# EAGLE design sous-vide (EAGLE 6.6.0)
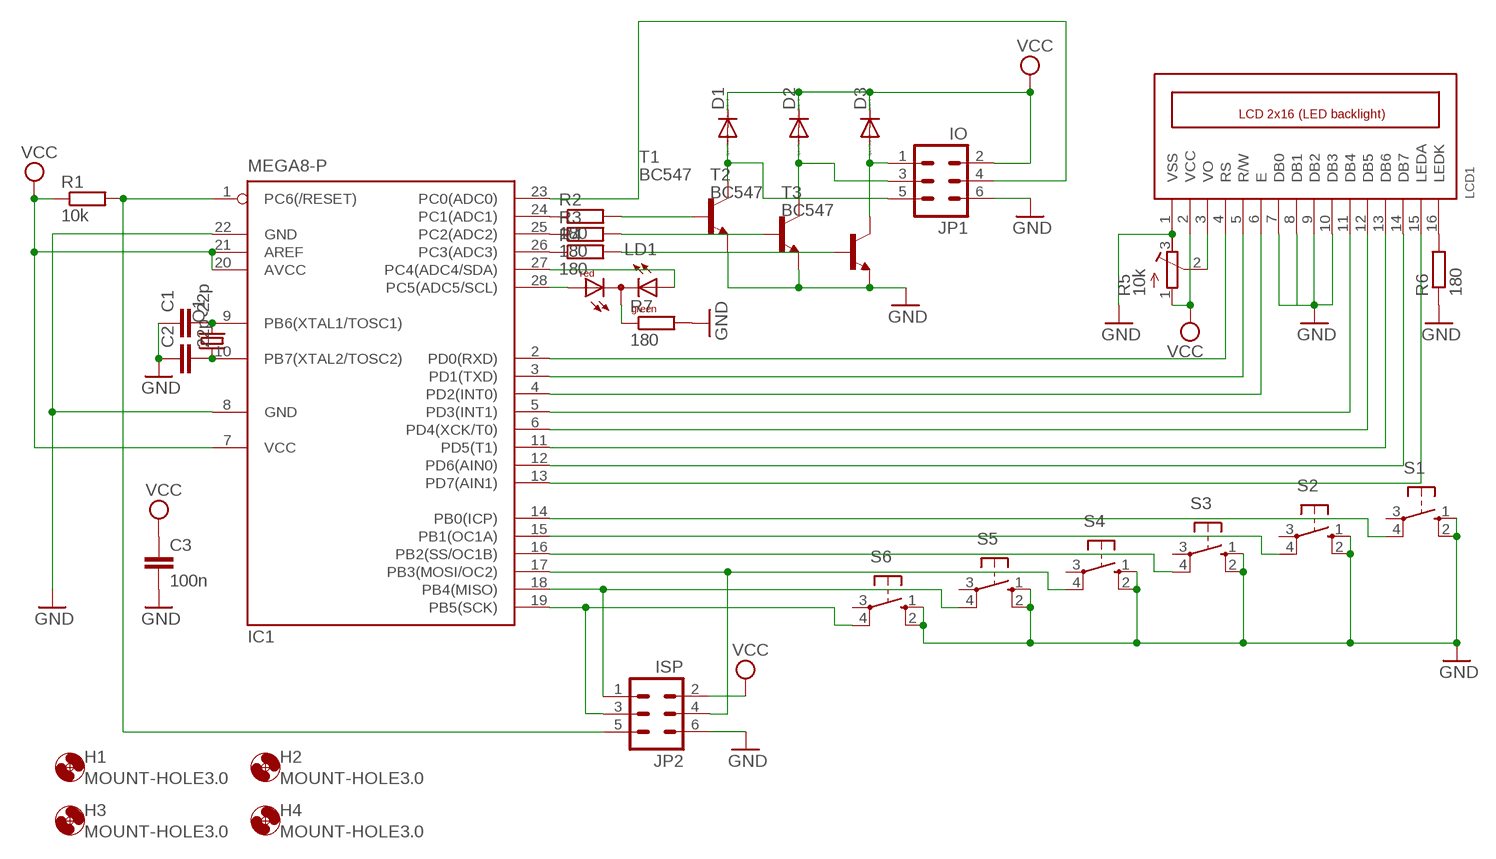
[diagram p0: schematic, sheet 1]

## Parts
C1  22p  C-EU025-025X050  [C025-025X050]
C2  22p  C-EU025-025X050  [C025-025X050]
C3  100n  C-EU025-025X050  [C025-025X050]
D1  DIODE-D-2.5  [D-2.5]
D2  DIODE-D-2.5  [D-2.5]
D3  DIODE-D-2.5  [D-2.5]
H1  MOUNT-HOLE3.0  [3,0]
H2  MOUNT-HOLE3.0  [3,0]
H3  MOUNT-HOLE3.0  [3,0]
H4  MOUNT-HOLE3.0  [3,0]
IC1  MEGA8-P  [DIL28-3]
JP1  IO  ML6  [ML6]
JP2  ISP  ML6  [ML6]
LCD1  LCD_2X16_SIL  [HY-1602F]
LD1  DUOLED-RG-C  [DUOLED-C-5MM]
Q1  CRYSTALHC49U-V  [HC49U-V]
R1  10k  R-EU_0207/7  [0207/7]
R2  180  R-EU_0207/2V  [0207/2V]
R3  180  R-EU_0207/2V  [0207/2V]
R4  180  R-EU_0207/2V  [0207/2V]
R5  10k  R-TRIMM3339P  [RTRIM3339P]
R6  180  R-EU_0207/7  [0207/7]
R7  180  R-EU_0207/7  [0207/7]
S1  40-XX  [B3F-40XX]
S2  40-XX  [B3F-40XX]
S3  40-XX  [B3F-40XX]
S4  40-XX  [B3F-40XX]
S5  40-XX  [B3F-40XX]
S6  40-XX  [B3F-40XX]
T1  BC547  [TO92]
T2  BC547  [TO92]
T3  BC547  [TO92]

## Nets
GND: C1.1 C2.1 C3.2 IC1.8(GND) IC1.22(GND) JP1.6 JP2.6 LCD1.1(VSS) LCD1.7(DB0) LCD1.8(DB1) LCD1.9(DB2) LCD1.10(DB3) R5.3(A) R6.1 R7.2 S1.1(S) S1.2(S1) S2.1(S) S2.2(S1) S3.1(S) S3.2(S1) S4.1(S) S4.2(S1) S5.1(S) S5.2(S1) S6.1(S) S6.2(S1) T1.1(E) T2.1(E) T3.1(E)
N$1: C1.2 IC1.9(PB6(XTAL1/TOSC1)) Q1.2
N$2: LCD1.16(LEDK) R6.2
N$3: IC1.23(PC0(ADC0)) JP1.4
N$4: IC1.24(PC1(ADC1)) R2.1
N$5: IC1.25(PC2(ADC2)) R3.1
N$6: IC1.26(PC3(ADC3)) R4.1
N$7: LD1.C R7.1
N$8: IC1.28(PC5(ADC5/SCL)) LD1.AR
N$9: IC1.27(PC4(ADC4/SDA)) LD1.AX(AG)
N$10: R2.2 T1.2(B)
N$11: R3.2 T2.2(B)
N$12: R4.2 T3.2(B)
N$13: D1.A JP1.5 T1.3(C)
N$14: LCD1.3(VO) R5.2(S)
N$15: C2.2 IC1.10(PB7(XTAL2/TOSC2)) Q1.1
N$16: D2.A JP1.3 T2.3(C)
N$17: D3.A JP1.1 T3.3(C)
N$18: IC1.19(PB5(SCK)) JP2.3 S6.4(P1)
N$19: IC1.18(PB4(MISO)) JP2.1 S5.4(P1)
N$21: IC1.2(PD0(RXD)) LCD1.4(RS)
N$22: IC1.3(PD1(TXD)) LCD1.5(R/W)
N$23: IC1.4(PD2(INT0)) LCD1.6(E)
N$24: IC1.17(PB3(MOSI/OC2)) JP2.4 S4.4(P1)
N$28: IC1.5(PD3(INT1)) LCD1.11(DB4)
N$30: IC1.6(PD4(XCK/T0)) LCD1.12(DB5)
N$31: IC1.1(PC6(/RESET)) JP2.5 R1.2
N$32: IC1.11(PD5(T1)) LCD1.13(DB6)
N$33: IC1.12(PD6(AIN0)) LCD1.14(DB7)
N$34: IC1.13(PD7(AIN1)) LCD1.15(LEDA)
N$35: IC1.16(PB2(SS/OC1B)) S3.4(P1)
N$36: IC1.14(PB0(ICP)) S1.4(P1)
N$37: IC1.15(PB1(OC1A)) S2.4(P1)
VCC: C3.1 D1.C D2.C D3.C IC1.7(VCC) IC1.20(AVCC) IC1.21(AREF) JP1.2 JP2.2 LCD1.2(VCC) R1.1 R5.1(E)
Unconnected: S1.3(P) S2.3(P) S3.3(P) S4.3(P) S5.3(P) S6.3(P)

## Library data of the parts
C1-C3 = resistor:C-EU: CAPACITOR, European symbol
D1-D3 = diode:DIODE-: DIODE
H1-H4 = holes:MOUNT-HOLE: MOUNTING HOLE with drill center marker
IC1 = atmel:MEGA8-P: MICROCONTROLLER 8 Kbytes FLASH, 1 kbytes SRAM, 512 bytes EEPROM, USART, 4-channel 10 bit ADC, 2-channel 8 bit ADC Pin compatible with Atmega48, ATMega88, ATMega168 Source: avr.lbr; OC_FARNELL: unknown; OC_NEWARK: unknown
JP1 JP2 = con-ml:ML6: HARTING; OC_FARNELL: unknown; OC_NEWARK: unknown
LCD1 = lcd_2x16_led_backlight:LCD_2X16_SIL
LD1 = led:DUOLED-RG-C: DUO LED 2 colors (red/green), 5 mm, round, common Cathode www.ligitek.com or other producers.
Q1 = crystal:CRYSTAL: CRYSTAL; OC_FARNELL: 1666969; OC_NEWARK: unknown
R1-R4 R6 R7 = rcl:R-EU_: RESISTOR, European symbol
R5 = resistor:R-TRIMM: Trimm resistor
S1-S6 = switch-omron:40-XX: OMRON SWITCH; MF: OMRON COMPONENTS USA; MPN: B3F-4000; OC_FARNELL: 176434; OC_NEWARK: 36K3105
T1-T3 = transistor:BC547: NPN TRANSISTOR

## Board
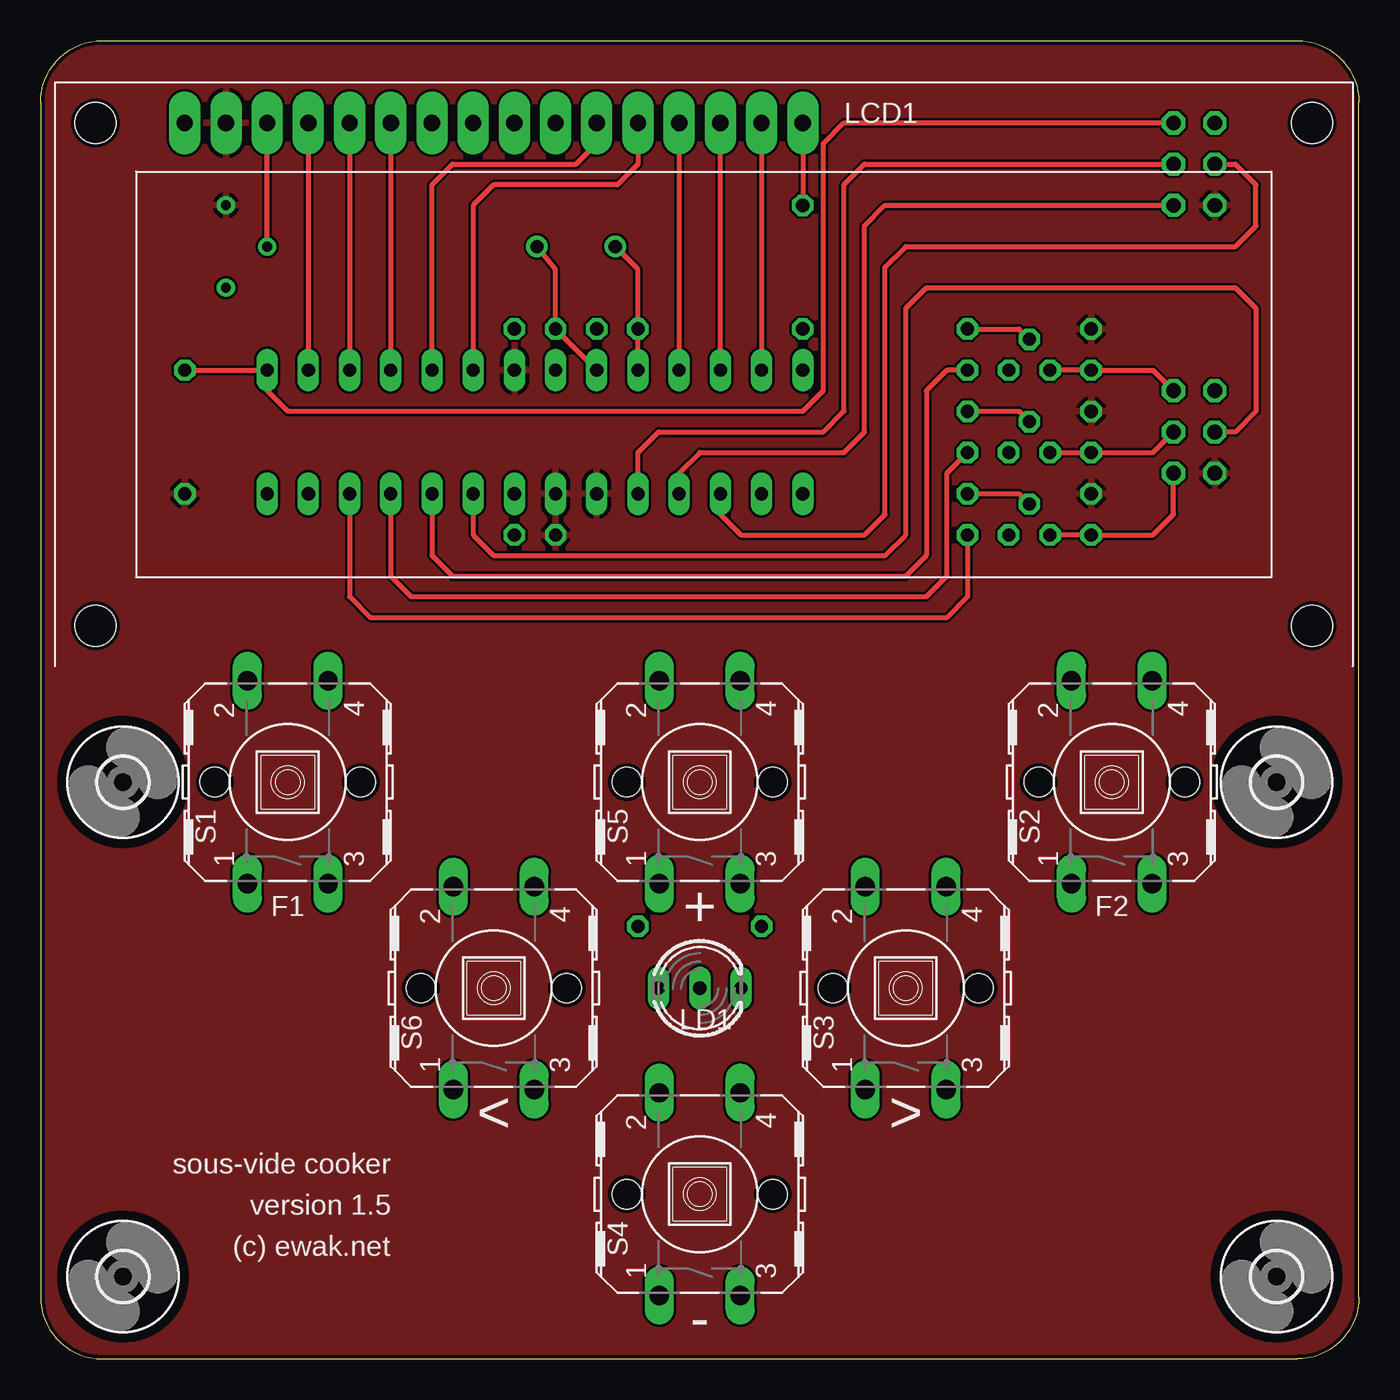
[diagram p1: board, top side]
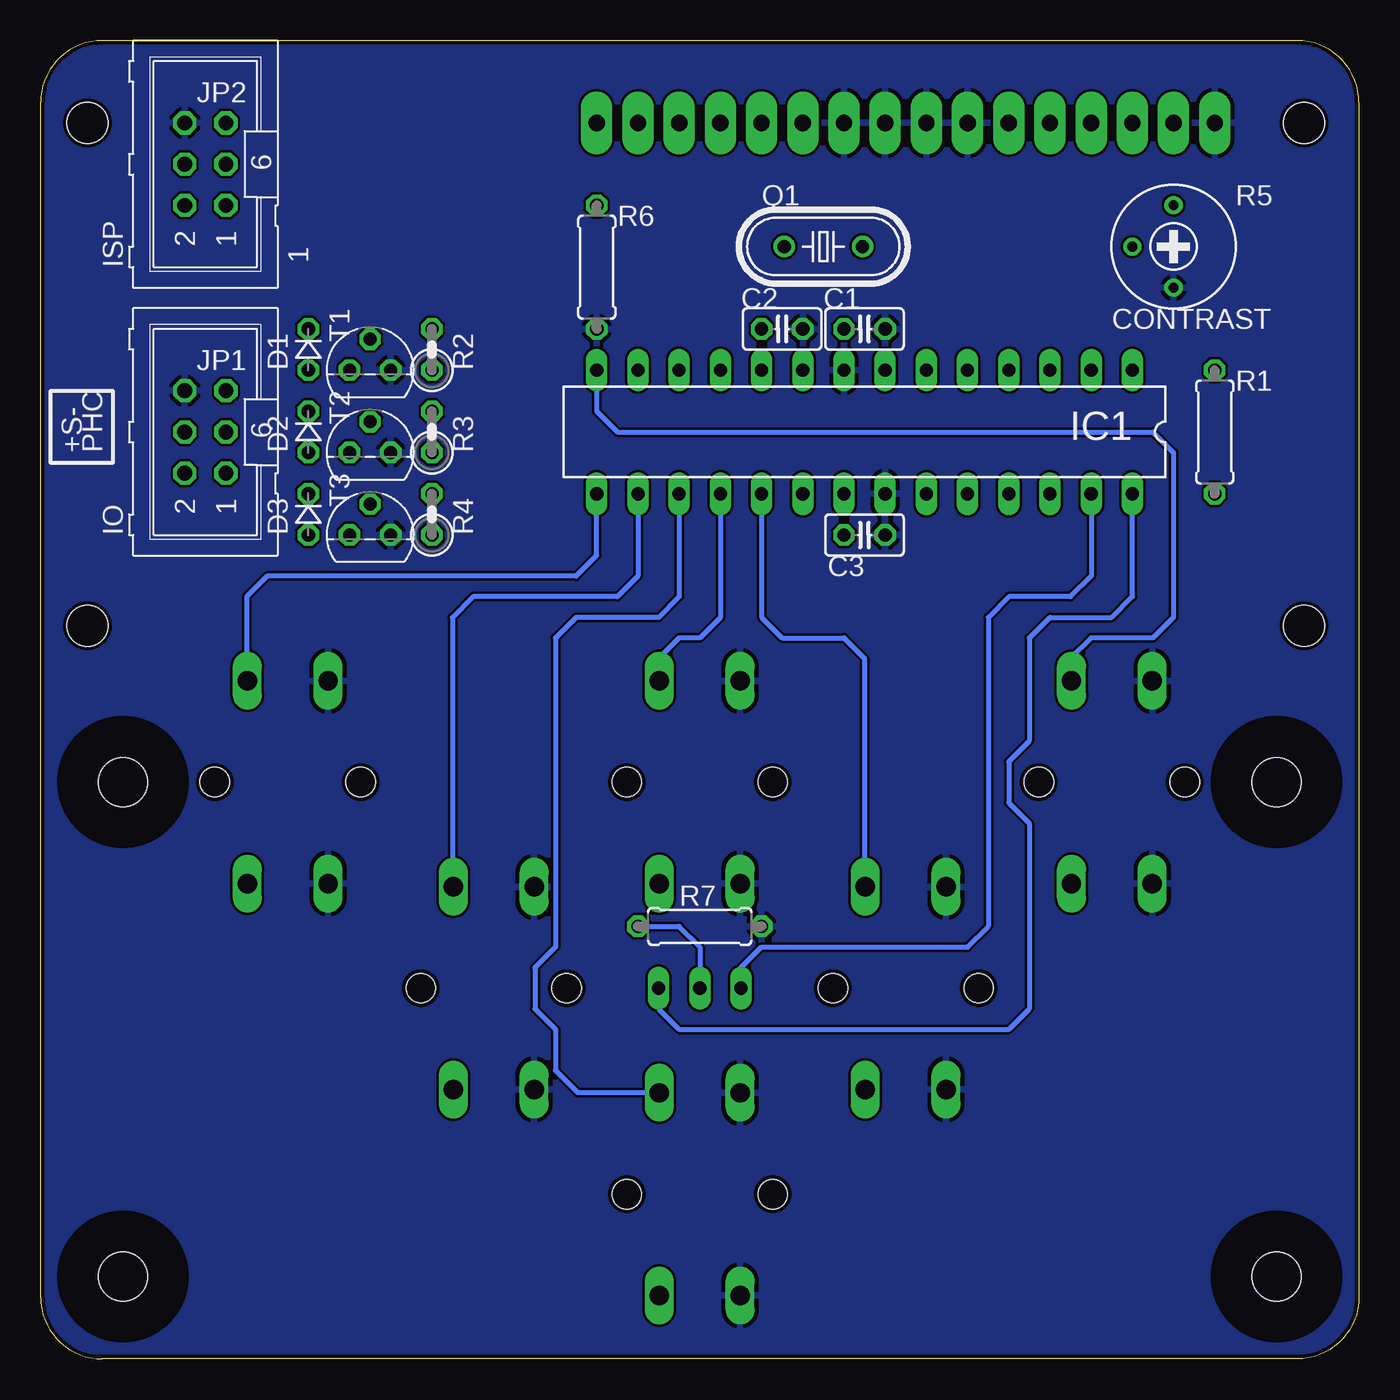
[diagram p2: board, bottom side, seen from below]

Size 81.28 x 81.28 mm. Coordinates in mm from the lower left corner, seen from the top.
Outline: 3.81,0 77.47,0 arc90 81.28,3.81 81.28,77.47 arc90 77.47,81.28 3.81,81.28 arc90 0,77.47 0,3.81 arc90 3.81,0
Copper layers (1*16): Top 0.035mm / dielectric 1.5mm / Bottom 0.035mm
Design rules "ITEADstudio_DRC": minimum track width 6mil, minimum drill 12mil, track to track 6mil, track to pad 6mil, pad to pad 6mil, via to via 6mil, smd to smd 0mil, copper to edge 10mil, drill to drill 10mil, minimum pad ring 10mil, minimum via ring 6mil, stop-mask expansion 2mil, vias tented up to drill 100mil, thermal gap 10mil

### Footprints (pad centres in the part's own frame; a part is rotated, then mirrored left to right if it is on the bottom)
C025-025X050 = drill 0.813 octagon: 1 -1.27,0; 2 1.27,0
D-2.5 = drill 0.813 octagon: A 1.27,0; C -1.27,0
3,0 = hole 3: 0,0
DIL28-3 = drill 0.813 long: 1 -16.51,-3.81; 2 -13.97,-3.81; 3 -11.43,-3.81; 4 -8.89,-3.81; 5 -6.35,-3.81; 6 -3.81,-3.81; 7 -1.27,-3.81; 8 1.27,-3.81; 9 3.81,-3.81; 10 6.35,-3.81; 11 8.89,-3.81; 12 11.43,-3.81; 13 13.97,-3.81; 14 16.51,-3.81; 15 16.51,3.81; 16 13.97,3.81; 17 11.43,3.81; 18 8.89,3.81; 19 6.35,3.81; 20 3.81,3.81; 21 1.27,3.81; 22 -1.27,3.81; 23 -3.81,3.81; 24 -6.35,3.81; 25 -8.89,3.81; 26 -11.43,3.81; 27 -13.97,3.81; 28 -16.51,3.81
ML6 = drill 0.914 octagon: 1 -2.54,-1.27; 2 -2.54,1.27; 3 0,-1.27; 4 0,1.27; 5 2.54,-1.27; 6 2.54,1.27
HY-1602F = drill 1 pad 1.93 long: 1 2.54,0; 2 5.08,0; 3 7.62,0; 4 10.16,0; 5 12.7,0; 6 15.24,0; 7 17.78,0; 8 20.32,0; 9 22.86,0; 10 25.4,0; 11 27.94,0; 12 30.48,0; 13 33.02,0; 14 35.56,0; 15 38.1,0; 16 40.64,0 | hole 2.5: -2.96,0; 72.04,0; -2.96,-31; 72.04,-31
DUOLED-C-5MM = drill 0.813 long: AR 2.54,0; AX -2.54,0; C 0,0
HC49U-V = drill 0.813: 1 -2.413,0; 2 2.413,0
0207/7 = drill 0.813 octagon: 1 -3.81,0; 2 3.81,0
0207/2V = drill 0.813 octagon: 1 -1.27,0; 2 1.27,0
RTRIM3339P = drill 0.61: 1 -2.54,0; 2 0,-2.54; 3 2.54,0
B3F-40XX = drill 1.194 long: 1 -6.248,2.489; 2 6.248,2.489; 3 -6.248,-2.489; 4 6.248,-2.489 | hole 1.803: 0,-4.496; 0,4.496
TO92 = drill 0.813 octagon: 1 1.27,0; 2 0,1.905; 3 -1.27,0

### Placement (x,y rotation side)
C1  30.48,63.5 180 bottom
C2  35.56,63.5 180 bottom
C3  30.48,50.8 0 bottom
D1  64.77,62.23 270 bottom
D2  64.77,57.15 270 bottom
D3  64.77,52.07 270 bottom
H1  76.2,5.08 0 top
H2  76.2,35.56 0 top
H3  5.08,35.56 0 top
H4  5.08,5.08 0 top
IC1  30.48,57.15 180 bottom
JP1  71.12,57.15 90 bottom
JP2  71.12,73.66 90 bottom
LCD1  6.35,76.2 0 top
LD1  40.64,22.86 0 top
Q1  33.02,68.58 0 bottom
R1  8.89,57.15 90 bottom
R2  57.15,62.23 90 bottom
R3  57.15,57.15 90 bottom
R4  57.15,52.07 90 bottom
R5  11.43,68.58 270 bottom
R6  46.99,67.31 90 bottom
R7  40.64,26.67 0 bottom
S1  15.24,35.56 90 top
S2  66.04,35.56 90 top
S3  53.34,22.86 90 top
S4  40.64,10.16 90 top
S5  40.64,35.56 90 top
S6  27.94,22.86 90 top
T1  60.96,60.96 0 bottom
T2  60.96,55.88 0 bottom
T3  60.96,50.8 0 bottom

### Tracks (layer width: path | path; a pad name or v marks a point on that pad's centre or on a via)
GND
  pour Bottom: 0,77.69 0,3.59 arc90 3.59,0 77.69,0 arc90 81.28,3.59 81.28,77.69 arc90 77.69,81.28 4.86,81.28 arc90
N$1
  Top 0.305: IC1.9 C1.2 31.75,67.18 Q1.2
N$2
  Top 0.305: LCD1.16 R6.2
N$3
  Top 0.305: IC1.23 26.67,50.8 27.94,49.53 52.07,49.53 53.34,50.8 53.34,64.77 54.61,66.04 73.66,66.04 74.93,64.77 74.93,58.42 73.66,57.15 JP1.4
N$4
  Top 0.305: IC1.24 24.13,49.53 25.4,48.26 53.34,48.26 54.61,49.53 54.61,59.69 55.88,60.96 R2.1
N$5
  Top 0.305: IC1.25 21.59,48.26 22.86,46.99 54.61,46.99 55.88,48.26 55.88,54.61 R3.1
N$6
  Top 0.305: IC1.26 19.05,46.99 20.32,45.72 55.88,45.72 57.15,46.99 R4.1
N$7
  Bottom 0.305: R7.1 41.91,26.67 40.64,25.4 LD1.C
N$8
  Bottom 0.305: LD1.AR 43.18,21.59 41.91,20.32 21.59,20.32 20.32,21.59 20.32,33.02 21.59,34.29 21.59,36.83 20.32,38.1 20.32,44.45 19.05,45.72 15.24,45.72 13.97,46.99 IC1.28
N$9
  Bottom 0.305: LD1.AX 38.1,24.13 36.83,25.4 24.13,25.4 22.86,26.67 22.86,45.72 21.59,46.99 17.78,46.99 16.51,48.26 IC1.27
N$10
  Top 0.305: R2.2 60.33,63.5 T1.2
N$11
  Top 0.305: T2.2 60.33,58.42 R3.2
N$12
  Top 0.305: T3.2 60.33,53.34 R4.2
N$13
  Top 0.305: T1.3 D1.A 68.58,60.96 JP1.5
N$14
  Top 0.305: R5.2 LCD1.3
N$15
  Top 0.305: IC1.10 C2.2 36.83,67.18 Q1.1
N$16
  Top 0.305: T2.3 D2.A 68.58,55.88 JP1.3
N$17
  Top 0.305: T3.3 D3.A 68.58,50.8 69.85,52.07 JP1.1
N$18
  Top 0.305: IC1.19 36.83,55.88 38.1,57.15 48.26,57.15 49.53,58.42 49.53,72.39 50.8,73.66 JP2.3
  Bottom 0.305: IC1.19 36.83,45.72 35.56,44.45 31.75,44.45 30.48,43.18 30.48,29.16 S6.4
N$19
  Top 0.305: IC1.18 39.37,54.61 40.64,55.88 49.53,55.88 50.8,57.15 50.8,69.85 52.07,71.12 JP2.1
  Bottom 0.305: IC1.18 39.37,45.72 40.64,44.45 41.91,44.45 43.18,43.18 43.18,41.86 S5.4
N$21
  Top 0.305: LCD1.4 IC1.2
N$22
  Top 0.305: LCD1.5 IC1.3
N$23
  Top 0.305: LCD1.6 IC1.4
N$24
  Top 0.305: IC1.17 41.91,52.07 43.18,50.8 50.8,50.8 52.07,52.07 52.07,67.31 53.34,68.58 73.66,68.58 74.93,69.85 74.93,72.39 73.66,73.66 JP2.4
  Bottom 0.305: S4.4 48.16,16.41 49.53,17.78 49.53,20.32 50.8,21.59 50.8,24.13 49.53,25.4 49.53,44.45 48.26,45.72 43.18,45.72 41.91,46.99 IC1.17
N$28
  Top 0.305: IC1.5 24.13,72.39 25.4,73.66 33.02,73.66 34.29,74.93 LCD1.11
N$30
  Top 0.305: LCD1.12 36.83,73.66 35.56,72.39 27.94,72.39 26.67,71.12 IC1.6
N$31
  Top 0.305: R1.2 IC1.1 13.97,59.69 15.24,58.42 46.99,58.42 48.26,59.69 48.26,74.93 49.53,76.2 JP2.5
N$32
  Top 0.305: LCD1.13 IC1.11
N$33
  Top 0.305: IC1.12 LCD1.14
N$34
  Top 0.305: LCD1.15 IC1.13
N$35
  Bottom 0.305: IC1.16 44.45,48.26 45.72,46.99 54.61,46.99 55.88,45.72 55.88,29.16 S3.4
N$36
  Bottom 0.305: S1.4 17.78,41.86 17.78,43.18 16.51,44.45 12.7,44.45 11.43,45.72 11.43,55.88 12.7,57.15 45.72,57.15 46.99,58.42 IC1.14
N$37
  Bottom 0.305: S2.4 68.53,47.04 67.31,48.26 48.26,48.26 46.99,49.53 IC1.15
VCC
  pour Top: 77.69,0 3.59,0 arc-90 0,3.59 0,77.69 arc-90 4.86,81.28 77.69,81.28 arc-90 81.28,77.69 81.28,3.59 arc-90

### Text on the board
tNames: F1 | + | F2 | < | > | sous-vide cooker | version 1.5 | (c) ewak.net | -
bNames: 1 | ISP | CONTRAST | PHC | +S- | IO